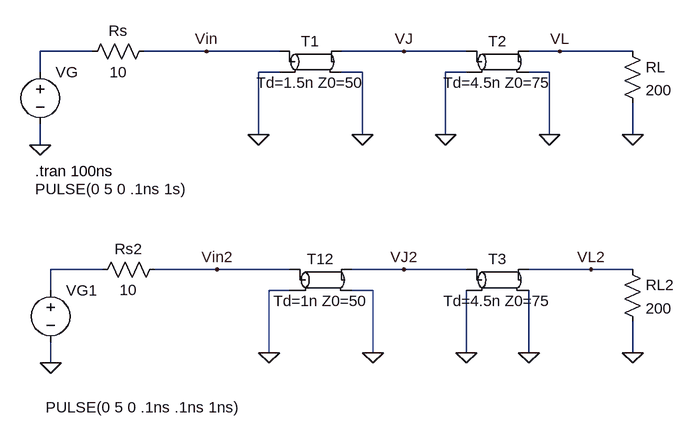
[diagram p0: schematic Tline_complesso_gradino.asc]
Tline_complesso_gradino.asc, the LTspice schematic file:
Version 4
SHEET 1 1300 692
WIRE 16 128 -64 128
WIRE 192 128 96 128
WIRE 304 128 192 128
WIRE 496 128 400 128
WIRE 592 128 496 128
WIRE 736 128 688 128
WIRE 848 128 736 128
WIRE -64 160 -64 128
WIRE 304 160 272 160
WIRE 432 160 400 160
WIRE 592 160 560 160
WIRE 720 160 688 160
WIRE 272 256 272 160
WIRE 432 256 432 160
WIRE 560 256 560 160
WIRE 720 256 720 160
WIRE 848 256 848 208
WIRE -64 272 -64 240
WIRE 32 464 -48 464
WIRE 208 464 112 464
WIRE 320 464 208 464
WIRE 496 464 416 464
WIRE 592 464 496 464
WIRE 784 464 688 464
WIRE 848 464 784 464
WIRE -48 496 -48 464
WIRE 320 496 288 496
WIRE 448 496 416 496
WIRE 288 592 288 496
WIRE 448 592 448 496
WIRE 592 592 592 496
WIRE 688 592 688 496
WIRE 848 592 848 544
WIRE -48 608 -48 576
FLAG -64 272 0
FLAG 272 256 0
FLAG 432 256 0
FLAG 192 128 Vin
FLAG 496 128 VJ
FLAG -48 608 0
FLAG 288 592 0
FLAG 448 592 0
FLAG 208 464 Vin2
FLAG 848 256 0
FLAG 848 592 0
FLAG 560 256 0
FLAG 720 256 0
FLAG 736 128 VL
FLAG 688 592 0
FLAG 592 592 0
FLAG 784 464 VL2
FLAG 496 464 VJ2
SYMBOL voltage -64 144 R0
WINDOW 123 0 0 Left 0
WINDOW 39 0 0 Left 0
WINDOW 3 -8 196 Left 2
SYMATTR Value PULSE(0 5 0 .1ns 1s)
SYMATTR InstName VG
SYMBOL tline 352 144 R0
SYMATTR InstName T1
SYMATTR Value Td=1.5n Z0=50
SYMBOL res 112 112 R90
WINDOW 0 0 56 VBottom 2
WINDOW 3 32 56 VTop 2
SYMATTR InstName Rs
SYMATTR Value 10
SYMBOL voltage -48 480 R0
WINDOW 123 0 0 Left 0
WINDOW 39 0 0 Left 0
WINDOW 3 -8 196 Left 2
SYMATTR Value PULSE(0 5 0 .1ns .1ns 1ns)
SYMATTR InstName VG1
SYMBOL tline 368 480 R0
SYMATTR InstName T12
SYMATTR Value Td=1n Z0=50
SYMBOL res 128 448 R90
WINDOW 0 0 56 VBottom 2
WINDOW 3 32 56 VTop 2
SYMATTR InstName Rs2
SYMATTR Value 10
SYMBOL res 832 112 R0
SYMATTR InstName RL
SYMATTR Value 200
SYMBOL res 832 448 R0
SYMATTR InstName RL2
SYMATTR Value 200
SYMBOL tline 640 144 R0
SYMATTR InstName T2
SYMATTR Value Td=4.5n Z0=75
SYMBOL tline 640 480 R0
SYMATTR InstName T3
SYMATTR Value Td=4.5n Z0=75
TEXT -72 312 Left 2 !.tran 100ns

The netlist it stands for:
* Tline_complesso_gradino.asc
VG N001 0 PULSE(0 5 0 .1ns 1s)
T1 Vin 0 VJ 0 Td=1.5n Z0=50
Rs Vin N001 10
VG1 N002 0 PULSE(0 5 0 .1ns .1ns 1ns)
T12 Vin2 0 VJ2 0 Td=1n Z0=50
Rs2 Vin2 N002 10
RL VL 0 200
RL2 VL2 0 200
T2 VJ 0 VL 0 Td=4.5n Z0=75
T3 VJ2 0 VL2 0 Td=4.5n Z0=75
.tran 100ns
.backanno
.end